# Altium project IronDoorControl.PrjPcb
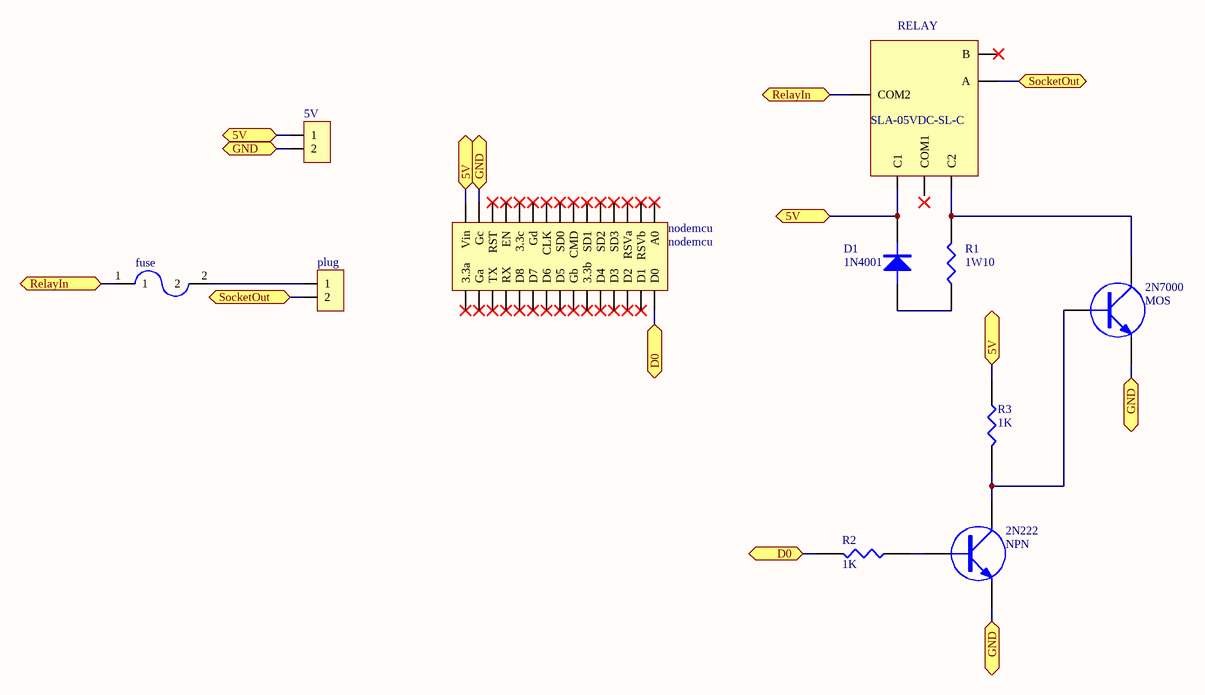
[diagram p0: IronDoorControl.SchDoc]
1 sheet, 11 parts. Net scope: flat (ports and power ports of the same name join across sheets).
Board file: IronDoorControl.PcbDoc

## Sheet IronDoorControl.SchDoc
size A4

### Parts
2N222  NPN  [TO92-MPS2222A]
2N7000  MOS  [TO92-MPS2222A]
5V  BigGreenMos  [BigGreenMos]  (value not drawn)
D1  1N4001  [DIODE8mm]
fuse  FUSE20mm  [FUSE20mm]  (value not drawn)
nodemcu  nodemcu  [nodemcu]
plug  BigGreenMos  [BigGreenMos]  (value not drawn)
R1  1W10  [RES0.6]
R2  1K  [RES0.4]
R3  1K  [RES0.4]
RELAY  SLA-05VDC-SL-C  [SLA-05VDC-SL-C]

### Ports
5V, D0, GND, RelayIn, SocketOut

### Nets
Net2N222_1: 2N222.1(B) R2.1
Net2N222_2: 2N222.2(C) 2N7000.1(B) R3.2
Net2N222_3: 2N222.3(E) 2N7000.3(E) 5V.2 nodemcu.Gc ; port GND
Net2N7000_2: 2N7000.2(C) R1.2 RELAY.C2
Net5V_1: 5V.1 D1.N nodemcu.Vin R3.1 RELAY.C1 ; port 5V
NetD1_P: D1.P R1.1
Netfuse_1: fuse.1 RELAY.COM2 ; port RelayIn
Netfuse_2: fuse.2 plug.1
Netnodemcu_D0: nodemcu.D0 R2.2 ; port D0
Netplug_2: plug.2 RELAY.A ; port SocketOut

Not connected (* = marked no-connect by the designer): nodemcu 3.3a* 3.3b* 3.3c* A0* CLK* CMD* D1* D2* D3* D4* D5* D6* D7* D8* EN* Ga* Gb* Gd* RST* RSVb(RSVa)* RX* SD0* SD1* SD2* SD3* TX*; RELAY B* COM1

### Library data of the parts
2N222 = NPN: NPN Transistor
2N7000 = NPN: NPN Transistor; pin to pad: 2>3 3>2
D1 = DIODE
R1-R3 = RES1